# EasyEDA schematic Wemos P1 DSMR5 hat.json
TITLE: Wemos P1 DSMR5 hat; REV: 1.0; Date: 2021-01-01; Sheet: 1/1; Company: None
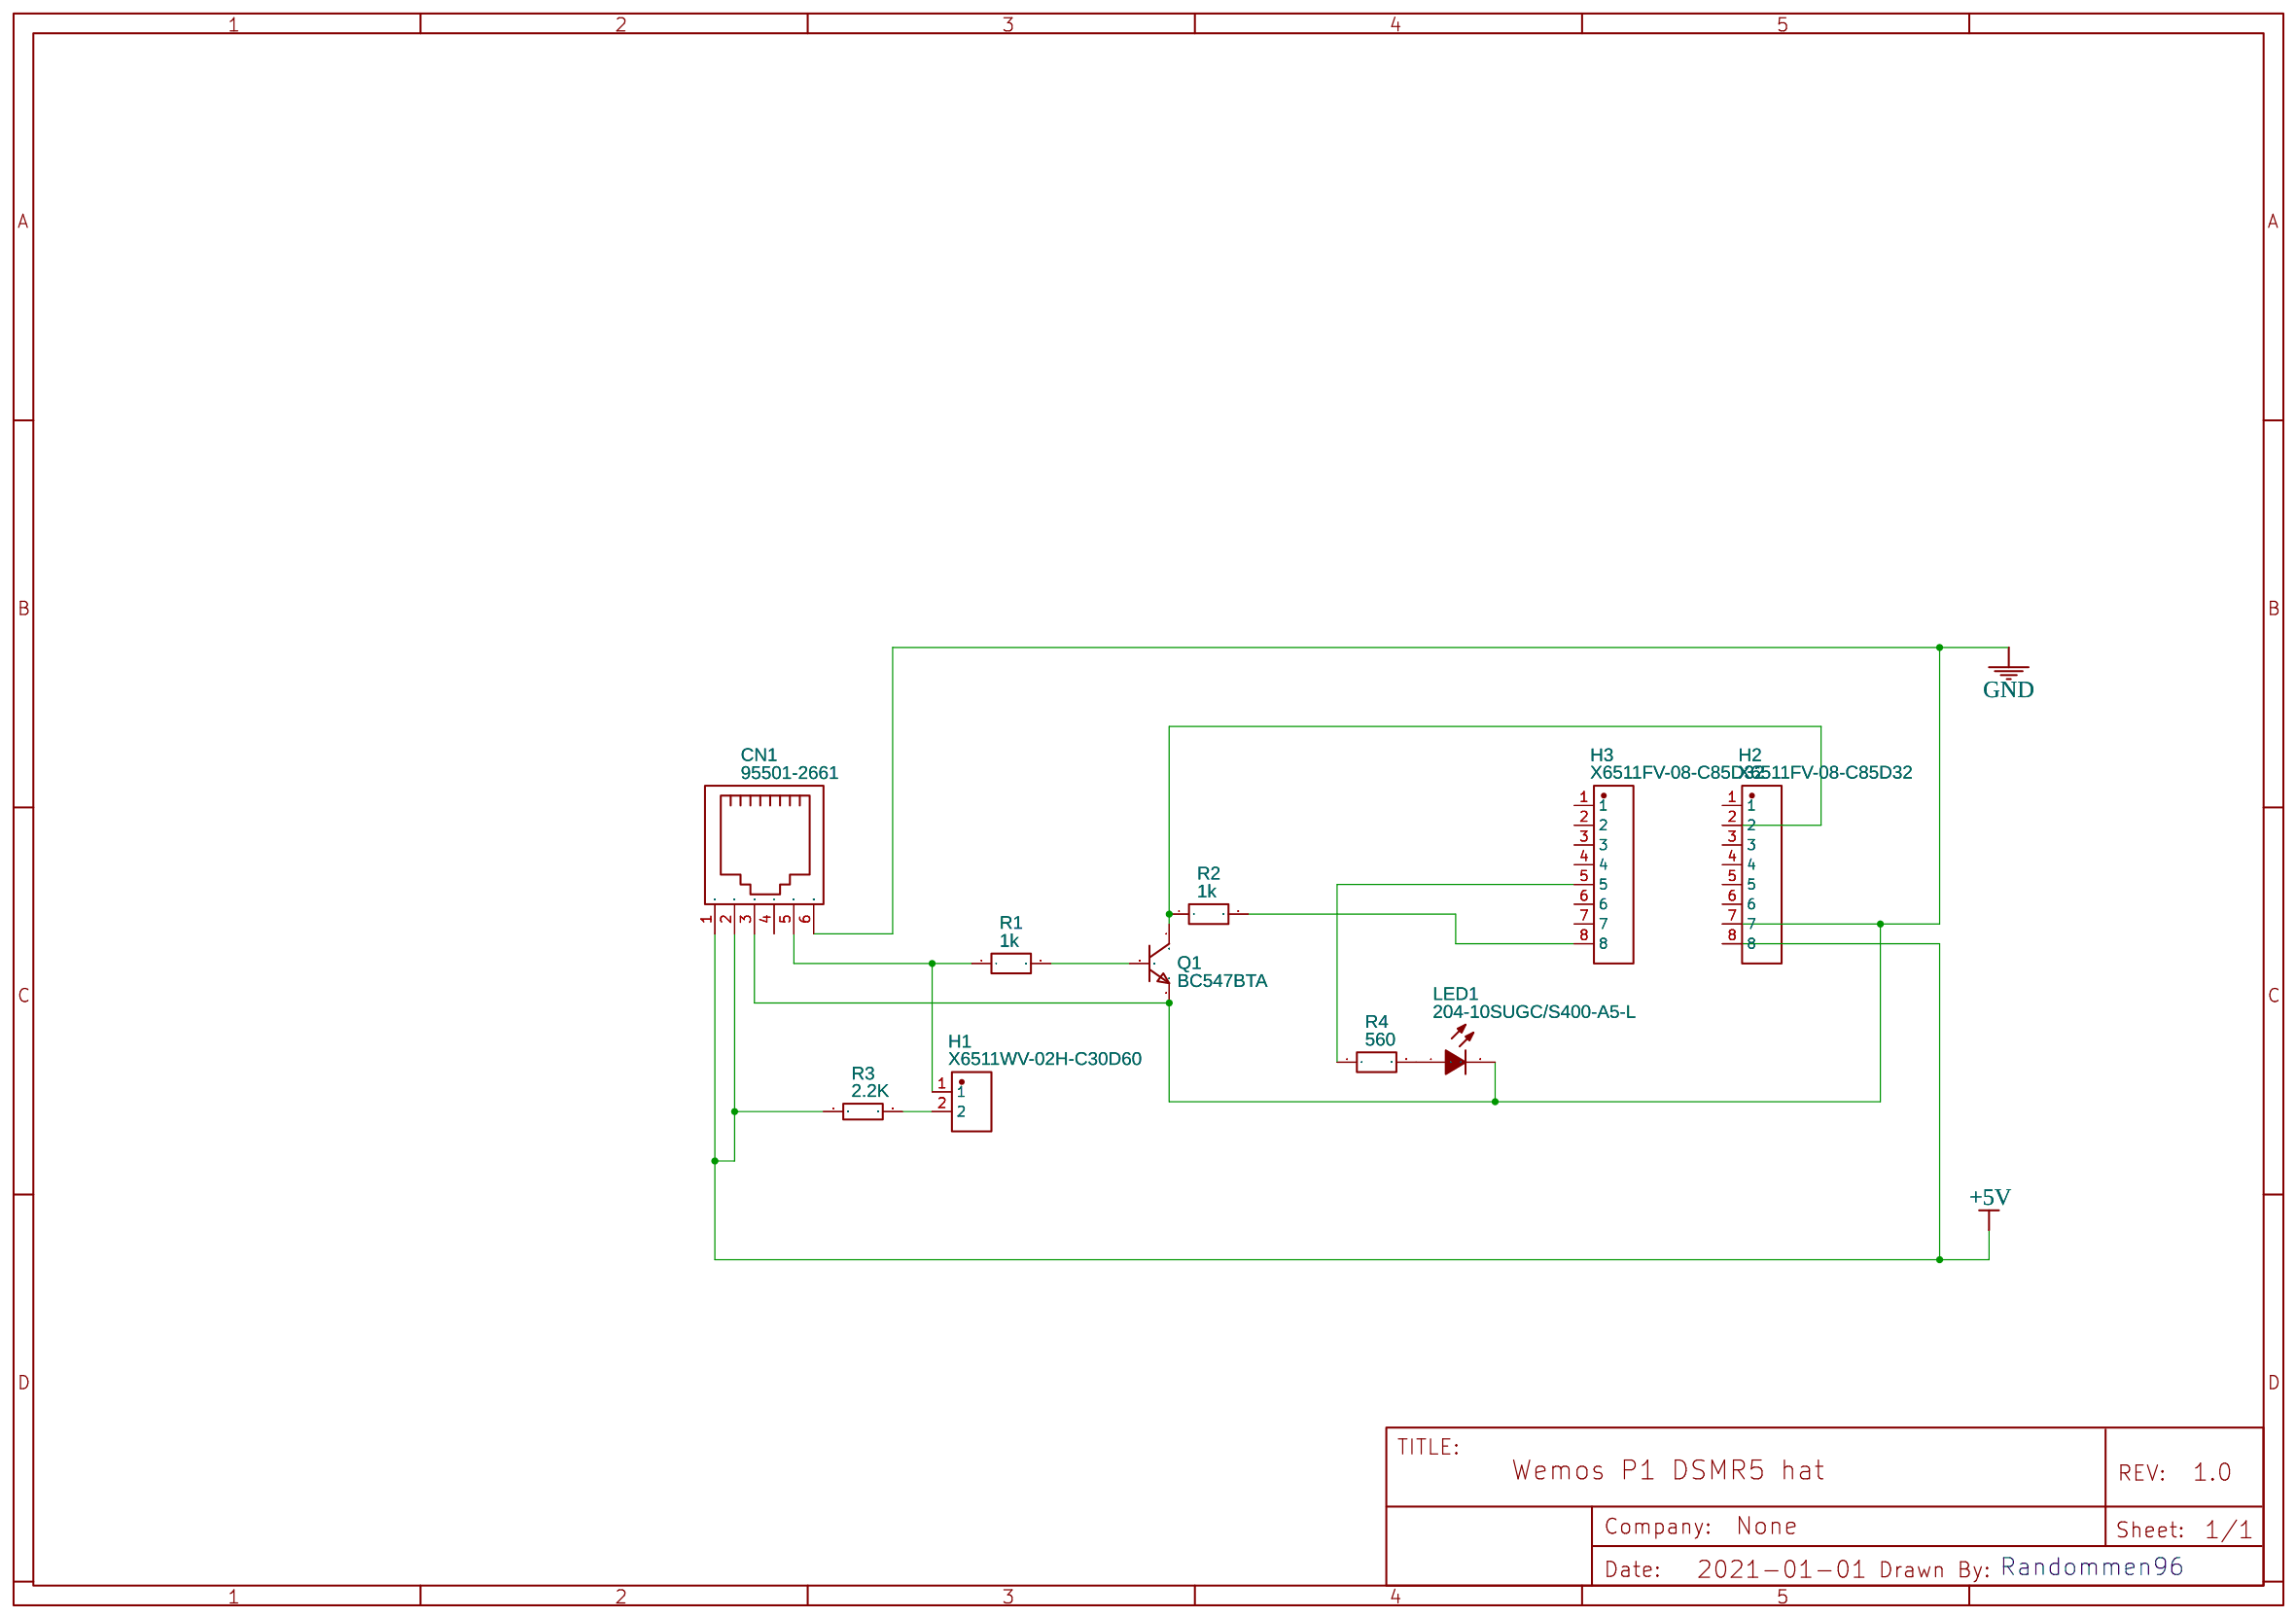
[diagram p0: schematic sheet]

## Parts
CN1  95501-2661  [RJ12-TH_95501-2661]
H1  X6511WV-02H-C30D60  [HDR-TH_2P-P2.54-V-M]
H2  X6511FV-08-C85D32  [HDR-TH_8P-P2.54-V-F]
H3  X6511FV-08-C85D32  [HDR-TH_8P-P2.54-V-F]
LED1  204-10SUGC/S400-A5-L  [LED-TH_BD3.0-P2.54-FD]
Q1  BC547BTA  [TO-92-3_L4.8-W3.7-P2.54-L]
R1  1k  [RES-TH_BD2.2-L6.5-P10.50-D0.9]
R2  1k  [RES-TH_BD2.2-L6.5-P10.50-D0.9]
R3  2.2K  [RES-TH_BD2.2-L6.5-P10.50-D0.6]
R4  560  [RES-TH_BD2.4-L6.3-P10.30-D0.6]

## Library data of the parts
CN1 = 95501-2661: Supplier: LCSC; Supplier Part: C240856; Manufacturer: MOLEX; Contributor: LCSC
H1 = X6511WV-02H-C30D60: Supplier: LCSC; Supplier Part: C706874; Manufacturer: XKB Connectivity; Contributor: LCSC
H2 H3 = X6511FV-08-C85D32: Supplier: LCSC; Supplier Part: C718237; Manufacturer: XKB Connectivity; Contributor: LCSC
LED1 = 204-10SUGC/S400-A5-L: Supplier: LCSC; Manufacturer: EVERLIGHT; Supplier Part: C99763
Q1 = BC547BTA: Supplier: LCSC; Supplier Part: C258144; Manufacturer: ON Semicon; Contributor: LCSC
R1 R2 = CFR0W4J0102A50_C66649: Supplier: LCSC; Supplier Part: C66649; Manufacturer: Uniroyal Elec; Manufacturer Part: CFR0W4J0102A50; Contributor: LCSC
R3 = CFR0W4J0222A50: Supplier: LCSC; Manufacturer: UniOhm; Supplier Part: C61295
R4 = RD 1/4W 560R J T/B A1: Supplier: LCSC; Supplier Part: C433706; Manufacturer: TyoHM; Contributor: LCSC

## Nets
+5V: CN1.1 CN1.2 H2.8 R3.1
GND: CN1.3 CN1.6 H2.7 LED1.2(K) Q1.3(E)
Net-(CN1-5): CN1.5 H1.1 R1.1
Net-(H1-2): H1.2 R3.2
Net-(H2-2): H2.2 Q1.1(C) R2.1
Net-(H3-5): H3.5 R4.1
Net-(H3-8): H3.8 R2.2
Net-(LED1-1): LED1.1(A) R4.2
Net-(Q1-2): Q1.2(B) R1.2

Not connected (* = marked no-connect by the designer): CN1 4; H2 1 3 4 5 6; H3 1 2 3 4 6 7

## Notes on the sheet
- Randommen96
